# Altium schematic sheet TITLE PAGE.SchDoc: TITLE PAGE
size A; SheetNumber: 1; SheetTotal: 8
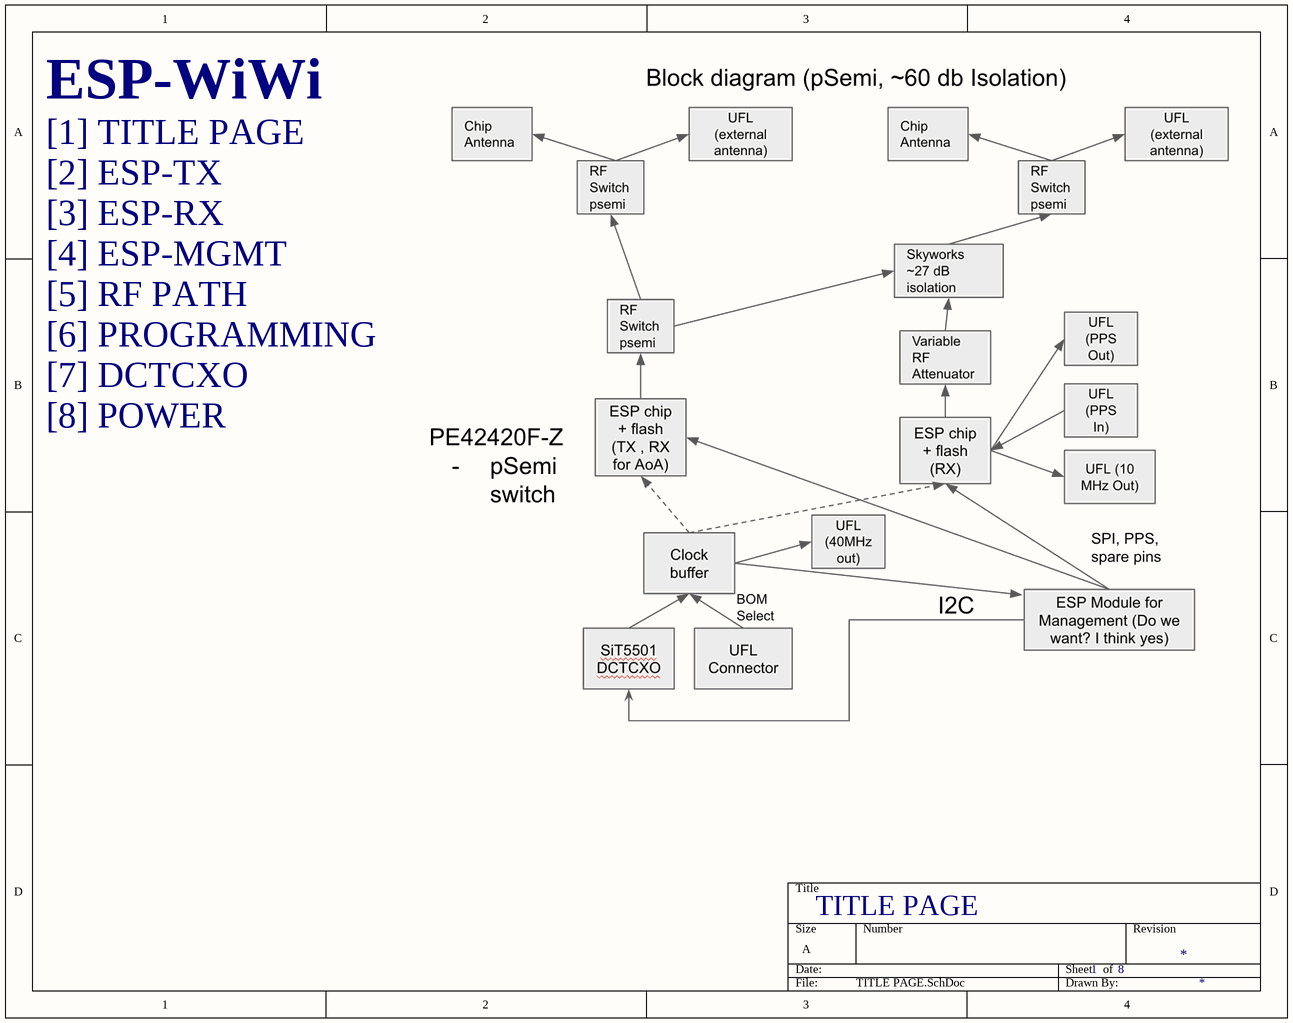
[diagram p0: TITLE PAGE.SchDoc]

## Notes on the sheet
- ESP-WiWi
- [1] TITLE PAGE
- [2] ESP-TX
- [3] ESP-RX
- [4] ESP-MGMT
- [5] RF PATH
- [6] PROGRAMMING
- [7] DCTCXO
- [8] POWER